# EAGLE design Tunnel_7button (EAGLE 9.5.2)
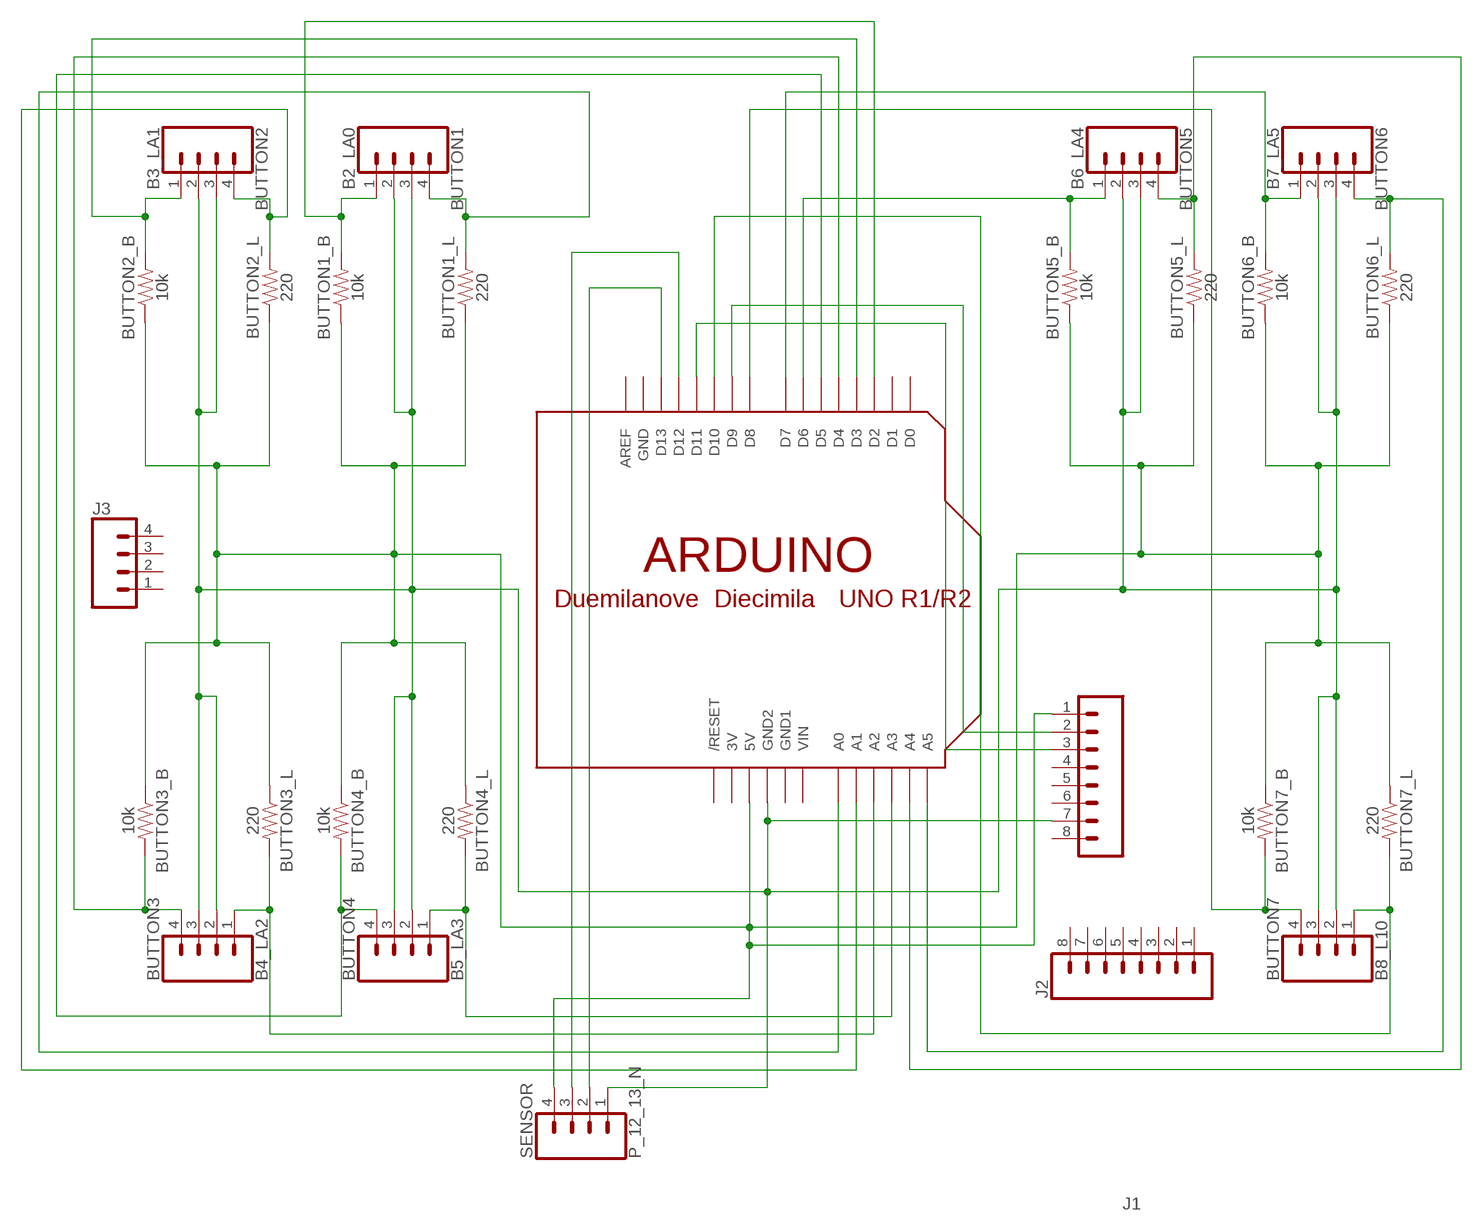
[diagram p0: schematic, sheet 1]

## Parts
BUTTON1  B2_LA0  CONN_04LOCK  [1X04_LOCK]
BUTTON1_B  10k  10KOHM-HORIZ-1/4W-1%  [AXIAL-0.3]
BUTTON1_L  220  10KOHM-HORIZ-1/4W-1%  [AXIAL-0.3]
BUTTON2  B3_LA1  CONN_04LOCK  [1X04_LOCK]
BUTTON2_B  10k  10KOHM-HORIZ-1/4W-1%  [AXIAL-0.3]
BUTTON2_L  220  10KOHM-HORIZ-1/4W-1%  [AXIAL-0.3]
BUTTON3  B4_LA2  CONN_04LOCK  [1X04_LOCK]
BUTTON3_B  10k  10KOHM-HORIZ-1/4W-1%  [AXIAL-0.3]
BUTTON3_L  220  10KOHM-HORIZ-1/4W-1%  [AXIAL-0.3]
BUTTON4  B5_LA3  CONN_04LOCK  [1X04_LOCK]
BUTTON4_B  10k  10KOHM-HORIZ-1/4W-1%  [AXIAL-0.3]
BUTTON4_L  220  10KOHM-HORIZ-1/4W-1%  [AXIAL-0.3]
BUTTON5  B6_LA4  CONN_04LOCK  [1X04_LOCK]
BUTTON5_B  10k  10KOHM-HORIZ-1/4W-1%  [AXIAL-0.3]
BUTTON5_L  220  10KOHM-HORIZ-1/4W-1%  [AXIAL-0.3]
BUTTON6  B7_LA5  CONN_04LOCK  [1X04_LOCK]
BUTTON6_B  10k  10KOHM-HORIZ-1/4W-1%  [AXIAL-0.3]
BUTTON6_L  220  10KOHM-HORIZ-1/4W-1%  [AXIAL-0.3]
BUTTON7  B8_L10  CONN_04LOCK  [1X04_LOCK]
BUTTON7_B  10k  10KOHM-HORIZ-1/4W-1%  [AXIAL-0.3]
BUTTON7_L  220  10KOHM-HORIZ-1/4W-1%  [AXIAL-0.3]
J1  CONN_08LOCK  [1X08_LOCK]
J2  CONN_08LOCK  [1X08_LOCK]
J3  CONN_04LOCK  [1X04_LOCK]
SENSOR  P_12_13_N  CONN_04LOCK  [1X04_LOCK]
U$1  ARDUINO-BPLACE  [ARDUINO-BPLACE]

## Nets
N$2: SENSOR.3 U$1.D12
N$3: SENSOR.2 U$1.D13
N$4: BUTTON2.1 BUTTON2_B.P$2 U$1.D3
N$5: BUTTON2.4 BUTTON2_L.P$2 U$1.A1
N$6: BUTTON1.1 BUTTON1_B.P$2 U$1.D2
N$7: BUTTON1.4 BUTTON1_L.P$2 U$1.A0
N$8: BUTTON1_B.P$1 BUTTON1_L.P$1 BUTTON2_B.P$1 BUTTON2_L.P$1 BUTTON3_B.P$1 BUTTON3_L.P$1 BUTTON4_B.P$1 BUTTON4_L.P$1 BUTTON5_B.P$1 BUTTON5_L.P$1 BUTTON6_B.P$1 BUTTON6_L.P$1 BUTTON7_B.P$1 BUTTON7_L.P$1 J1.1 SENSOR.4 U$1.5V
N$9: BUTTON5.1 BUTTON5_B.P$2 U$1.D6
N$10: BUTTON4.1 BUTTON4_L.P$2 U$1.A3
N$11: BUTTON4.4 BUTTON4_B.P$2 U$1.D5
N$12: BUTTON5.4 BUTTON5_L.P$2 U$1.A4
N$13: BUTTON1.2 BUTTON1.3 BUTTON2.2 BUTTON2.3 BUTTON3.2 BUTTON3.3 BUTTON4.2 BUTTON4.3 BUTTON5.2 BUTTON5.3 BUTTON6.2 BUTTON6.3 BUTTON7.2 BUTTON7.3 J1.7 SENSOR.1 U$1.GND2
N$14: BUTTON3.1 BUTTON3_L.P$2 U$1.A2
N$15: BUTTON3.4 BUTTON3_B.P$2 U$1.D4
N$16: BUTTON6.1 BUTTON6_B.P$2 U$1.D7
N$17: BUTTON6.4 BUTTON6_L.P$2 U$1.A5
N$18: BUTTON7.1 BUTTON7_L.P$2 U$1.D10
N$19: BUTTON7.4 BUTTON7_B.P$2 U$1.D8
N$20: J1.3 U$1.D11
N$21: J1.2 U$1.D9
Unconnected: J1.4 J1.5 J1.6 J1.8 J2.1 J2.2 J2.3 J2.4 J2.5 J2.6 J2.7 J2.8 J3.1 J3.2 J3.3 J3.4 U$1.AREF U$1.D0 U$1.D1 U$1.RESET(/RESET)

## Power pins joined to a net without a drawn wire
3V: U$1.3V
GND: U$1.GND
GND1: U$1.GND1
VIN: U$1.VIN

## Library data of the parts
BUTTON1-BUTTON7 = SparkFun-Connectors:CONN_04: Multi connection point. Often used as Generic Header-pin footprint for 0.1 inch spaced/style header connections On any of the 0.1 inch spaced packages, you can populate with these: Break Away Headers - Straight <https://www.sparkfun.com/products/116> (PRT-00116) Break Away Male Headers - Right Angle <https://www.sparkfun.com/products/553> (PRT-00553) Female Headers <https://www.sparkfun.com/products/115> (PRT-00115) Break Away Headers - Machine Pin <https://www.sparkfun.com/products/117> (PRT-00117) Break Away Female Headers - Swiss Machine Pin <https://www.sparkfun.com/products/743> (PRT-00743) For SCREWTERMINALS and SPRING TERMINALS visit here: Screw Terimnals on SparkFun.com <https://www.sparkfun.com/search/results?term=Screw+Terminals> (5mm/3.5mm/2.54mm spacing) This device is also useful as a general connection point to wire up your design to another part of your project. Our various solder wires solder well into these plated through hole pads. Hook-Up Wire - Assortment (Stranded, 22 AWG) <https://www.sparkfun.com/products/11375> (PRT-11375) Hook-Up Wire - Assortment (Solid Core, 22 AWG) <https://www.sparkfun.com/products/11367> (PRT-11367) View the entire wire category on our website here <https://www.sparkfun.com/categories/141> Special notes: Molex polarized connector foot print use with SKU : PRT-08231 with associated crimp pins and housings. 1MM SMD Version SKU: PRT-10208
BUTTON1_B BUTTON2_B BUTTON3_B BUTTON4_B BUTTON5_B BUTTON6_B BUTTON7_B = SparkFun-Resistors:10KOHM: 10kΩ resistor A resistor is a passive two-terminal electrical component that implements electrical resistance as a circuit element. Resistors act to reduce current flow, and, at the same time, act to lower voltage levels within circuits. - Wikipedia; PROD_ID: RES-12183
BUTTON1_L BUTTON2_L BUTTON3_L BUTTON4_L BUTTON5_L BUTTON6_L BUTTON7_L = SparkFun-Resistors:10KOHM: 10kΩ resistor A resistor is a passive two-terminal electrical component that implements electrical resistance as a circuit element. Resistors act to reduce current flow, and, at the same time, act to lower voltage levels within circuits. - Wikipedia; PROD_ID: RES-12183; VALUE: 10k
J1 J2 = SparkFun-Connectors:CONN_08: Multi connection point. Often used as Generic Header-pin footprint for 0.1 inch spaced/style header connections On any of the 0.1 inch spaced packages, you can populate with these: Break Away Headers - Straight <https://www.sparkfun.com/products/116> (PRT-00116) Break Away Male Headers - Right Angle <https://www.sparkfun.com/products/553> (PRT-00553) Female Headers <https://www.sparkfun.com/products/115> (PRT-00115) Break Away Headers - Machine Pin <https://www.sparkfun.com/products/117> (PRT-00117) Break Away Female Headers - Swiss Machine Pin <https://www.sparkfun.com/products/743> (PRT-00743) Arduino Stackable Header - 8 Pin <https://www.sparkfun.com/products/9279> (PRT-09279) For SCREWTERMINALS and SPRING TERMINALS visit here: Screw Terimnals on SparkFun.com <https://www.sparkfun.com/search/results?term=Screw+Terminals> (5mm/3.5mm/2.54mm spacing) This device is also useful as a general connection point to wire up your design to another part of your project. Our various solder wires solder well into these plated through hole pads. Hook-Up Wire - Assortment (Stranded, 22 AWG) <https://www.sparkfun.com/products/11375> (PRT-11375) Hook-Up Wire - Assortment (Solid Core, 22 AWG) <https://www.sparkfun.com/products/11367> (PRT-11367) View the entire wire category on our website here <https://www.sparkfun.com/categories/141> Special notes: Molex polarized connector foot print use with SKU : PRT-08231 with associated crimp pins and housings. 1MM SMD Version SKU: PRT-10208 NOTES ON THE VARIANTS LOCK and LOCK_LONGPADS... This footprint was designed to help hold the alignment of a through-hole component (i.e. 6-pin header) while soldering it into place. You may notice that each hole has been shifted either up or down by 0.005 of an inch from it's more standard position (which is a perfectly straight line). This slight alteration caused the pins (the squares in the middle) to touch the edges of the holes. Because they are alternating, it causes a "brace" to hold the component in place. 0.005 has proven to be the perfect amount of "off-center" position when using our standard breakaway headers. Although looks a little odd when you look at the bare footprint, once you have a header in there, the alteration is very hard to notice. Also,if you push a header all the way into place, it is covered up entirely on the bottom side.
J3 SENSOR = SparkFun-Connectors:CONN_04: Multi connection point. Often used as Generic Header-pin footprint for 0.1 inch spaced/style header connections On any of the 0.1 inch spaced packages, you can populate with these: Break Away Headers - Straight <https://www.sparkfun.com/products/116> (PRT-00116) Break Away Male Headers - Right Angle <https://www.sparkfun.com/products/553> (PRT-00553) Female Headers <https://www.sparkfun.com/products/115> (PRT-00115) Break Away Headers - Machine Pin <https://www.sparkfun.com/products/117> (PRT-00117) Break Away Female Headers - Swiss Machine Pin <https://www.sparkfun.com/products/743> (PRT-00743) For SCREWTERMINALS and SPRING TERMINALS visit here: Screw Terimnals on SparkFun.com <https://www.sparkfun.com/search/results?term=Screw+Terminals> (5mm/3.5mm/2.54mm spacing) This device is also useful as a general connection point to wire up your design to another part of your project. Our various solder wires solder well into these plated through hole pads. Hook-Up Wire - Assortment (Stranded, 22 AWG) <https://www.sparkfun.com/products/11375> (PRT-11375) Hook-Up Wire - Assortment (Solid Core, 22 AWG) <https://www.sparkfun.com/products/11367> (PRT-11367) View the entire wire category on our website here <https://www.sparkfun.com/categories/141> Special notes: Molex polarized connector foot print use with SKU : PRT-08231 with associated crimp pins and housings. 1MM SMD Version SKU: PRT-10208; PROD_ID: CONN-09696
U$1 = adafruit:ARDUINO: Arduino Diecimila/Duemilanove Make a shield with ease, this package has all the named pins as well as the two mounting drill holes and an outline of the USB and DC power connector. The outline is on the DIMENSION layer, so if your board house uses it they will cut the outline to match. http://www.ladyada.net/library/pcb/eaglelibrary.html

## Board
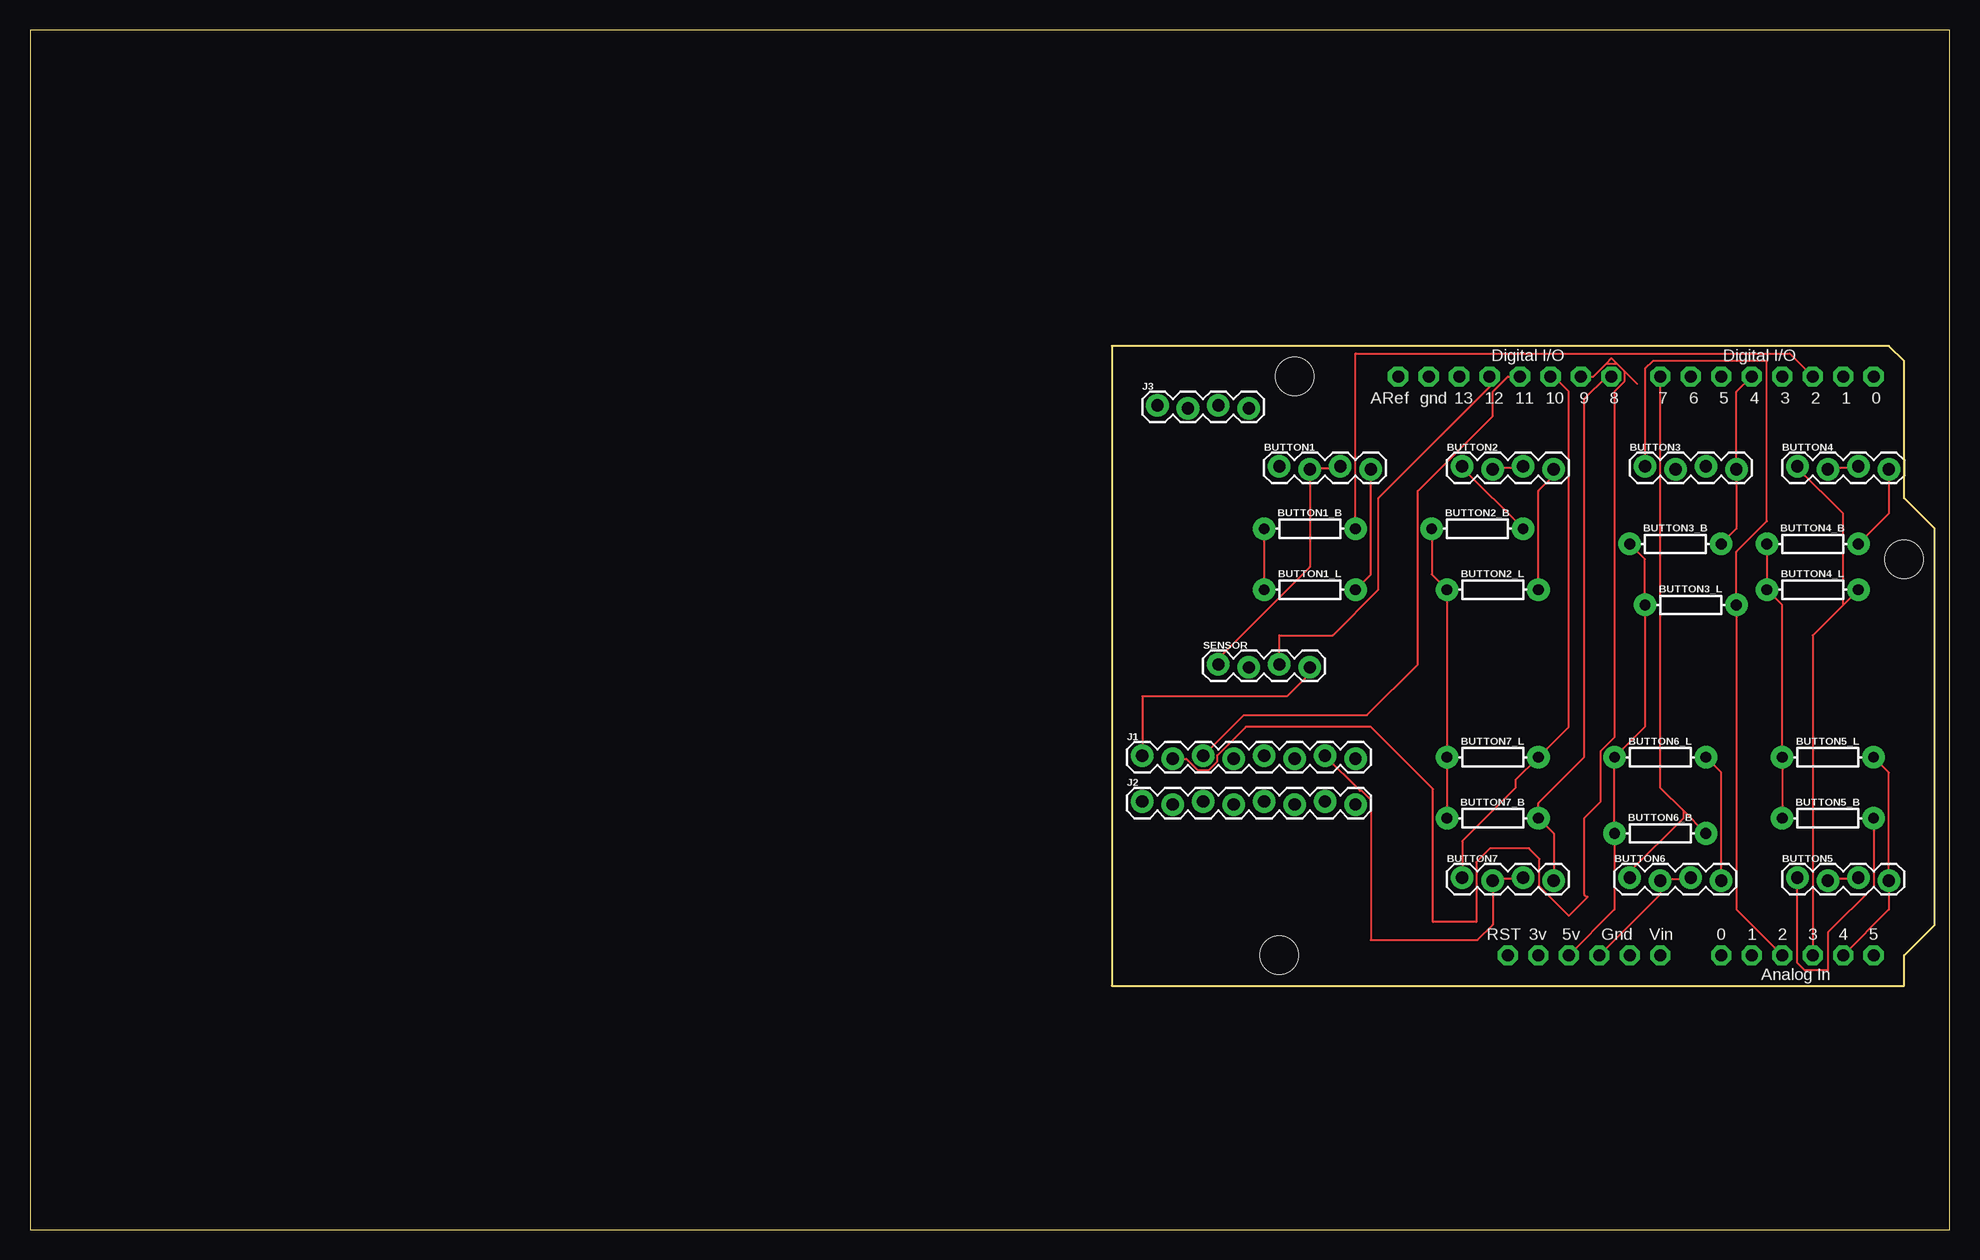
[diagram p1: board, top side]
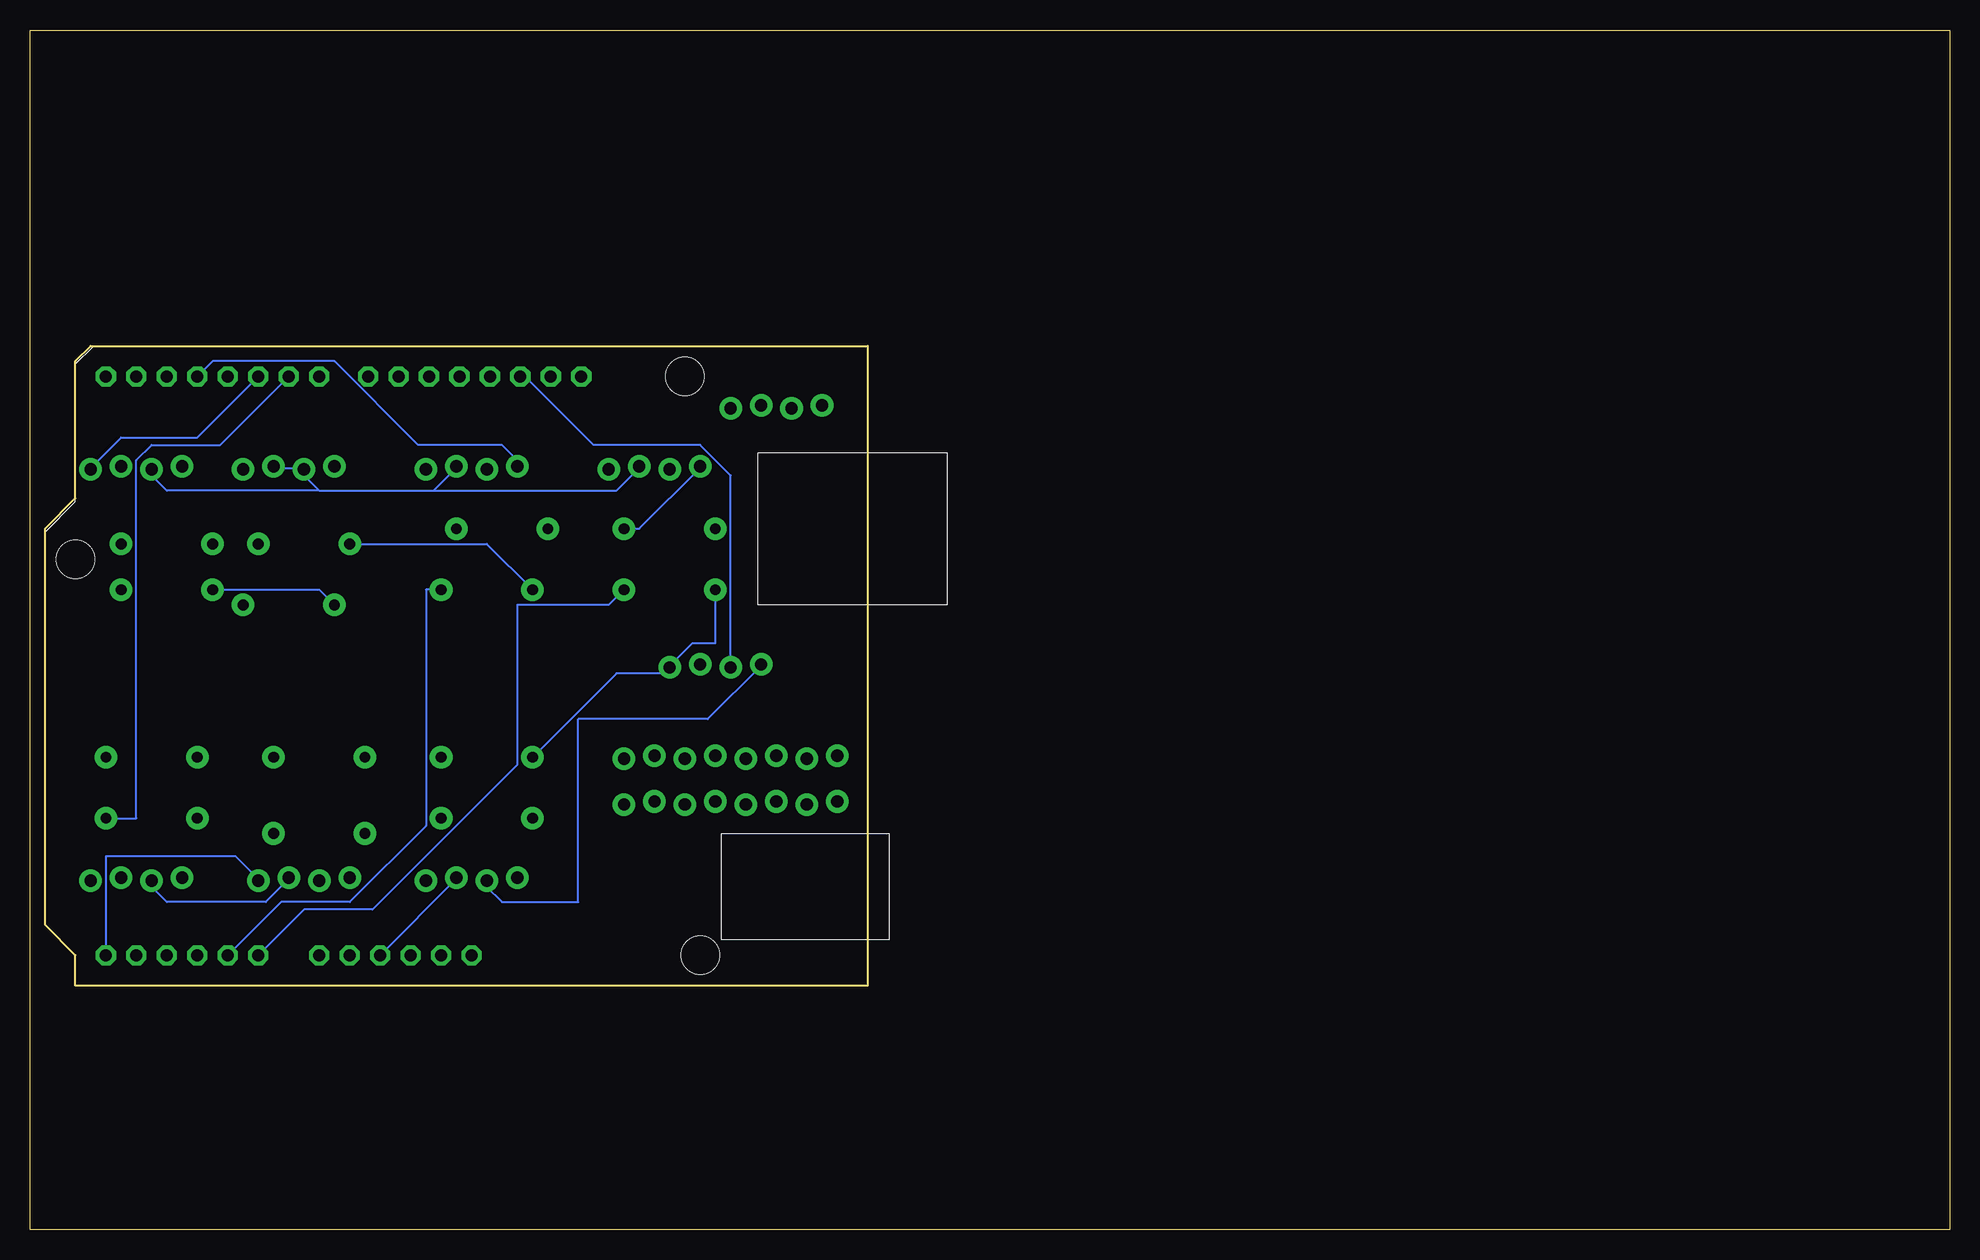
[diagram p2: board, bottom side, seen from below]

Size 160 x 100 mm. Coordinates in mm from the lower left corner, seen from the top.
Outline: 0,0 160,0 160,100 0,100 0,0
Copper layers (1*16): Top 0.035mm / dielectric 1.5mm / Bottom 0.035mm
Design rules "default": minimum track width 6mil, minimum drill 0.35mm, track to track 6mil, track to pad 6mil, pad to pad 6mil, via to via 6mil, smd to smd 6mil, copper to edge 40mil, drill to drill 6mil, minimum pad ring 10mil, minimum via ring 8mil, stop-mask expansion 4mil, vias tented up to drill 0mil, thermal gap 10mil

### Footprints (pad centres in the part's own frame; a part is rotated, then mirrored left to right if it is on the bottom)
1X04_LOCK = drill 1.016 pad 1.88: 1 0,0.127; 2 2.54,-0.127; 3 5.08,0.127; 4 7.62,-0.127
AXIAL-0.3 = drill 0.9 pad 1.88: P$1 -3.81,0; P$2 3.81,0
1X08_LOCK = drill 1.016 pad 1.88: 1 0,0.127; 2 2.54,-0.127; 3 5.08,0.127; 4 7.62,-0.127; 5 10.16,0.127; 6 12.7,-0.127; 7 15.24,0.127; 8 17.78,-0.127
ARDUINO-BPLACE = drill 1 pad 1.676 octagon: 3V 35.56,2.54; 5V 38.1,2.54; A0 50.8,2.54; A1 53.34,2.54; A2 55.88,2.54; A3 58.42,2.54; A4 60.96,2.54; A5 63.5,2.54; AREF 23.876,50.8; D0 63.5,50.8; D1 60.96,50.8; D2 58.42,50.8; D3 55.88,50.8; D4 53.34,50.8; D5 50.8,50.8; D6 48.26,50.8; D7 45.72,50.8; D8 41.656,50.8; D9 39.116,50.8; D10 36.576,50.8; D11 34.036,50.8; D12 31.496,50.8; D13 28.956,50.8; GND 26.416,50.8; GND1 43.18,2.54; GND2 40.64,2.54; RESET 33.02,2.54; VIN 45.72,2.54 | hole 3.2: 15.24,50.8; 66.04,35.56; 13.97,2.54

### Placement (x,y rotation side)
BUTTON1  104.14,63.5 0 top
BUTTON1_B  106.68,58.42 0 top
BUTTON1_L  106.68,53.34 0 top
BUTTON2  119.38,63.5 0 top
BUTTON2_B  120.65,58.42 0 top
BUTTON2_L  121.92,53.34 0 top
BUTTON3  134.62,63.5 0 top
BUTTON3_B  137.16,57.15 0 top
BUTTON3_L  138.43,52.07 0 top
BUTTON4  147.32,63.5 0 top
BUTTON4_B  148.59,57.15 0 top
BUTTON4_L  148.59,53.34 0 top
BUTTON5  147.32,29.21 0 top
BUTTON5_B  149.86,34.29 0 top
BUTTON5_L  149.86,39.37 0 top
BUTTON6  133.35,29.21 0 top
BUTTON6_B  135.89,33.02 0 top
BUTTON6_L  135.89,39.37 0 top
BUTTON7  119.38,29.21 0 top
BUTTON7_B  121.92,34.29 0 top
BUTTON7_L  121.92,39.37 0 top
J1  92.71,39.37 0 top
J2  92.71,35.56 0 top
J3  93.98,68.58 0 top
SENSOR  99.06,46.99 0 top
U$1  90.17,20.32 0 top

### Tracks (layer width: path | path; a pad name or v marks a point on that pad's centre or on a via)
N$2
  Top 0.152: U$1.D12 121.67,70.23 112.39,60.96 112.39,53.34 108.58,49.53 104.14,49.53 SENSOR.3
N$3
  Bottom 0.152: SENSOR.2 101.6,62.87 104.14,65.41 113.03,65.41 118.75,71.12 U$1.D13
N$4
  Top 0.152: BUTTON2_B.P$2 119.38,63.5 BUTTON2.1
  Bottom 0.152: U$1.D3 144.78,72.39 134.62,72.39 127.64,65.41 120.65,65.41 119.38,64.14 BUTTON2.1
N$5
  Top 0.152: BUTTON2_L.P$2 125.73,61.59 127,62.87 BUTTON2.4
  Bottom 0.152: U$1.A1 139.06,27.3 133.35,27.3 127,33.66 127,53.34 BUTTON2_L.P$2
N$6
  Top 0.152: U$1.D2 146.69,73.03 110.49,73.03 BUTTON1_B.P$2
  Bottom 0.152: BUTTON1_B.P$2 109.22,58.42 104.14,63.5 BUTTON1.1
N$7
  Top 0.152: BUTTON1.4 111.76,54.61 BUTTON1_L.P$2
  Bottom 0.152: U$1.A0 137.16,26.67 131.44,26.67 119.38,38.73 119.38,52.07 111.76,52.07 BUTTON1_L.P$2
N$8
  Top 0.152: BUTTON7_B.P$1 BUTTON7_L.P$1 BUTTON2_L.P$1 116.84,54.61 BUTTON2_B.P$1 | BUTTON1_B.P$1 BUTTON1_L.P$1 | SENSOR.4 106.68,46.35 104.78,44.45 92.71,44.45 J1.1 | U$1.5V 132.08,26.67 BUTTON6_B.P$1 BUTTON6_L.P$1 134.62,41.91 BUTTON3_L.P$1 134.62,55.88 BUTTON3_B.P$1 | BUTTON4_B.P$1 BUTTON4_L.P$1 146.05,52.07 BUTTON5_L.P$1 BUTTON5_B.P$1
  Bottom 0.152: BUTTON1_L.P$1 102.87,48.9 104.78,48.9 106.68,46.99 SENSOR.4 106.68,46.35 111.12,46.35 BUTTON7_L.P$1 | BUTTON3_L.P$1 135.89,53.34 BUTTON4_L.P$1 | BUTTON2_L.P$1 121.92,57.15 BUTTON3_B.P$1
N$9
  Top 0.152: BUTTON5.1 147.32,22.23 147.96,21.59 149.86,21.59 149.86,24.77 153.67,28.57 BUTTON5_B.P$2
  Bottom 0.152: U$1.D6 144.15,65.41 149.86,65.41 151.13,64.14 151.13,34.29 BUTTON5_B.P$2
N$10
  Top 0.152: U$1.A3 148.59,49.53 151.13,52.07 | BUTTON4_L.P$2 151.13,52.07 | 151.13,52.07 151.13,59.69 147.32,63.5 BUTTON4.1
N$11
  Top 0.152: BUTTON4_B.P$2 154.94,59.69 BUTTON4.4
  Bottom 0.152: U$1.D5 146.05,66.04 152.4,66.04 154.94,63.5 BUTTON4.4
N$12
  Top 0.152: U$1.A4 154.94,26.67 BUTTON5.4 154.94,38.1 BUTTON5_L.P$2
N$13
  Top 0.152: BUTTON7.3 124.46,29.21 121.92,29.21 BUTTON7.2 121.92,25.4 120.65,24.13 111.76,24.13 111.76,35.81 110.97,36.6 110.85,36.6 J1.7 | BUTTON5.2 149.86,29.21 152.4,29.21 BUTTON5.3 | U$1.GND2 135.89,27.94 BUTTON6.2 135.89,29.21 138.43,29.21 BUTTON6.3 | SENSOR.1 99.06,47.62 106.68,55.24 BUTTON1.2 106.68,63.5 109.22,63.5 BUTTON1.3 | BUTTON4.2 149.86,63.5 152.4,63.5 BUTTON4.3 | BUTTON2.2 121.92,63.5 124.46,63.5 BUTTON2.3
  Bottom 0.152: BUTTON7.2 121.92,28.57 120.65,27.3 114.3,27.3 114.3,42.55 103.5,42.55 99.06,46.99 SENSOR.1 | BUTTON5.2 149.86,28.57 148.59,27.3 140.34,27.3 138.43,29.21 BUTTON6.3 | U$1.GND2 124.46,29.21 BUTTON7.3 | BUTTON3.3 139.7,63.5 137.16,63.5 BUTTON3.2 137.16,62.87 135.89,61.59 | 126.36,61.59 124.46,63.5 BUTTON2.3 | 135.89,61.59 126.36,61.59 | 135.89,61.59 148.59,61.59 149.86,62.87 BUTTON4.2 | 126.36,61.59 111.12,61.59 109.22,63.5 BUTTON1.3
N$14
  Top 0.152: U$1.A2 142.24,26.67 BUTTON3_L.P$2 142.24,56.52 144.78,59.05 144.78,72.39 135.25,72.39 134.62,71.75 BUTTON3.1
N$15
  Top 0.152: U$1.D4 142.24,69.85 BUTTON3.4 142.24,58.42 BUTTON3_B.P$2
N$16
  Top 0.152: U$1.D7 135.89,36.83 137.79,34.92 | BUTTON6_B.P$2 137.79,34.92 | 137.79,34.92 137.79,34.29 133.35,29.84 BUTTON6.1
N$17
  Top 0.152: BUTTON6_L.P$2 140.97,38.1 BUTTON6.4
  Bottom 0.152: U$1.A5 153.67,31.11 142.88,31.11 140.97,29.21 BUTTON6.4
N$18
  Top 0.152: U$1.D10 127,71.12 128.27,69.85 128.27,41.91 BUTTON7_L.P$2 123.83,37.47 123.83,36.83 119.38,32.38 BUTTON7.1
N$19
  Top 0.152: U$1.D8 131.44,71.12 129.54,69.22 129.54,39.37 125.73,35.56 BUTTON7_B.P$2 127,33.02 BUTTON7.4
N$20
  Top 0.152: J1.3 101.17,42.88 111.45,42.88 115.67,47.09 115.67,61.57 121.92,67.82 121.92,69.85 123.19,71.12 U$1.D11
N$21
  Top 0.152: J1.2 96.39,39.24 97.31,38.33 98.27,38.33 98.96,39.01 98.96,39.52 101.34,41.91 111.76,41.91 116.94,36.73 116.94,25.63 120.55,25.63 120.55,30.63 121.69,31.77 124.94,31.77 125.83,30.89 125.83,28.6 126.75,27.68 128.27,26.16 129.79,27.68 | 133.97,70.48 131.83,72.63 131.38,72.19 | 129.84,27.73 129.79,27.68 | 129.79,27.68 129.54,27.94 129.54,34.29 130.91,35.66 130.91,39.85 132.08,41.02 132.08,69.86 132.89,70.68 132.89,71.56 132.27,72.19 131.38,72.19 | U$1.D9 130.32,71.12 131.38,72.19